# Altium schematic sheet 中心连接板.SchDoc
size A4
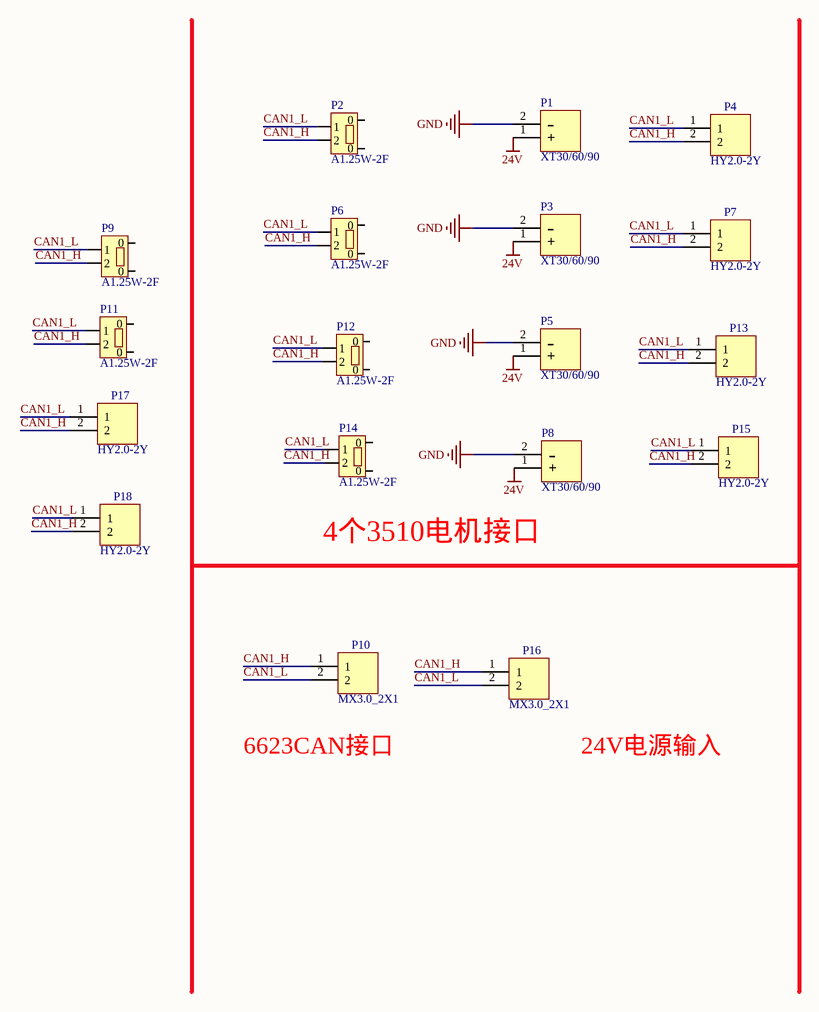
[diagram p0: 中心连接板.SchDoc]

## Parts
P1  XT30/60/90  [XT30立式]
P2  A1.25W-2F  [GH1.25_立式]
P3  XT30/60/90  [XT30立式]
P4  HY2.0-2Y  [HY2.00MM 2X1_立式]
P5  XT30/60/90  [XT30立式]
P6  A1.25W-2F  [GH1.25_立式]
P7  HY2.0-2Y  [HY2.00MM 2X1_立式]
P8  XT30/60/90  [XT30立式]
P9  A1.25W-2F  [GH1.25_立式]
P10  MX3.0_2X1  [MX3.0_2X1_立式]
P11  A1.25W-2F  [GH1.25_立式]
P12  A1.25W-2F  [GH1.25_立式]
P13  HY2.0-2Y  [HY2.00MM 2X1_立式]
P14  A1.25W-2F  [GH1.25_立式]
P15  HY2.0-2Y  [HY2.00MM 2X1_立式]
P16  MX3.0_2X1  [MX3.0_2X1_立式]
P17  HY2.0-2Y  [HY2.00MM 2X1_立式]
P18  HY2.0-2Y  [HY2.00MM 2X1_立式]

## Nets
24V: P1.1(+) P3.1(+) P5.1(+) P8.1(+)
GND: P1.2(-) P3.2(-) P5.2(-) P8.2(-)
CAN1_H: P2.2 P4.2 P6.2 P7.2 P9.2 P10.1 P11.2 P12.2 P13.2 P14.2 P15.2 P16.1 P17.2 P18.2
CAN1_L: P2.1 P4.1 P6.1 P7.1 P9.1 P10.2 P11.1 P12.1 P13.1 P14.1 P15.1 P16.2 P17.1 P18.1

Not connected (* = marked no-connect by the designer): P2 0; P6 0; P9 0; P11 0; P12 0; P14 0

## Notes on the sheet
- (near P14) 4个3510电机接口
- 6623CAN接口
- 24V电源输入

## Library data of the parts
P2 P6 P9 P11 P12 P14 = GH1.25-2P
P4 P7 P13 P15 P17 P18 = MX3.0_2X1